# EAGLE design ProDuino-v2 (EAGLE 6.5.0)
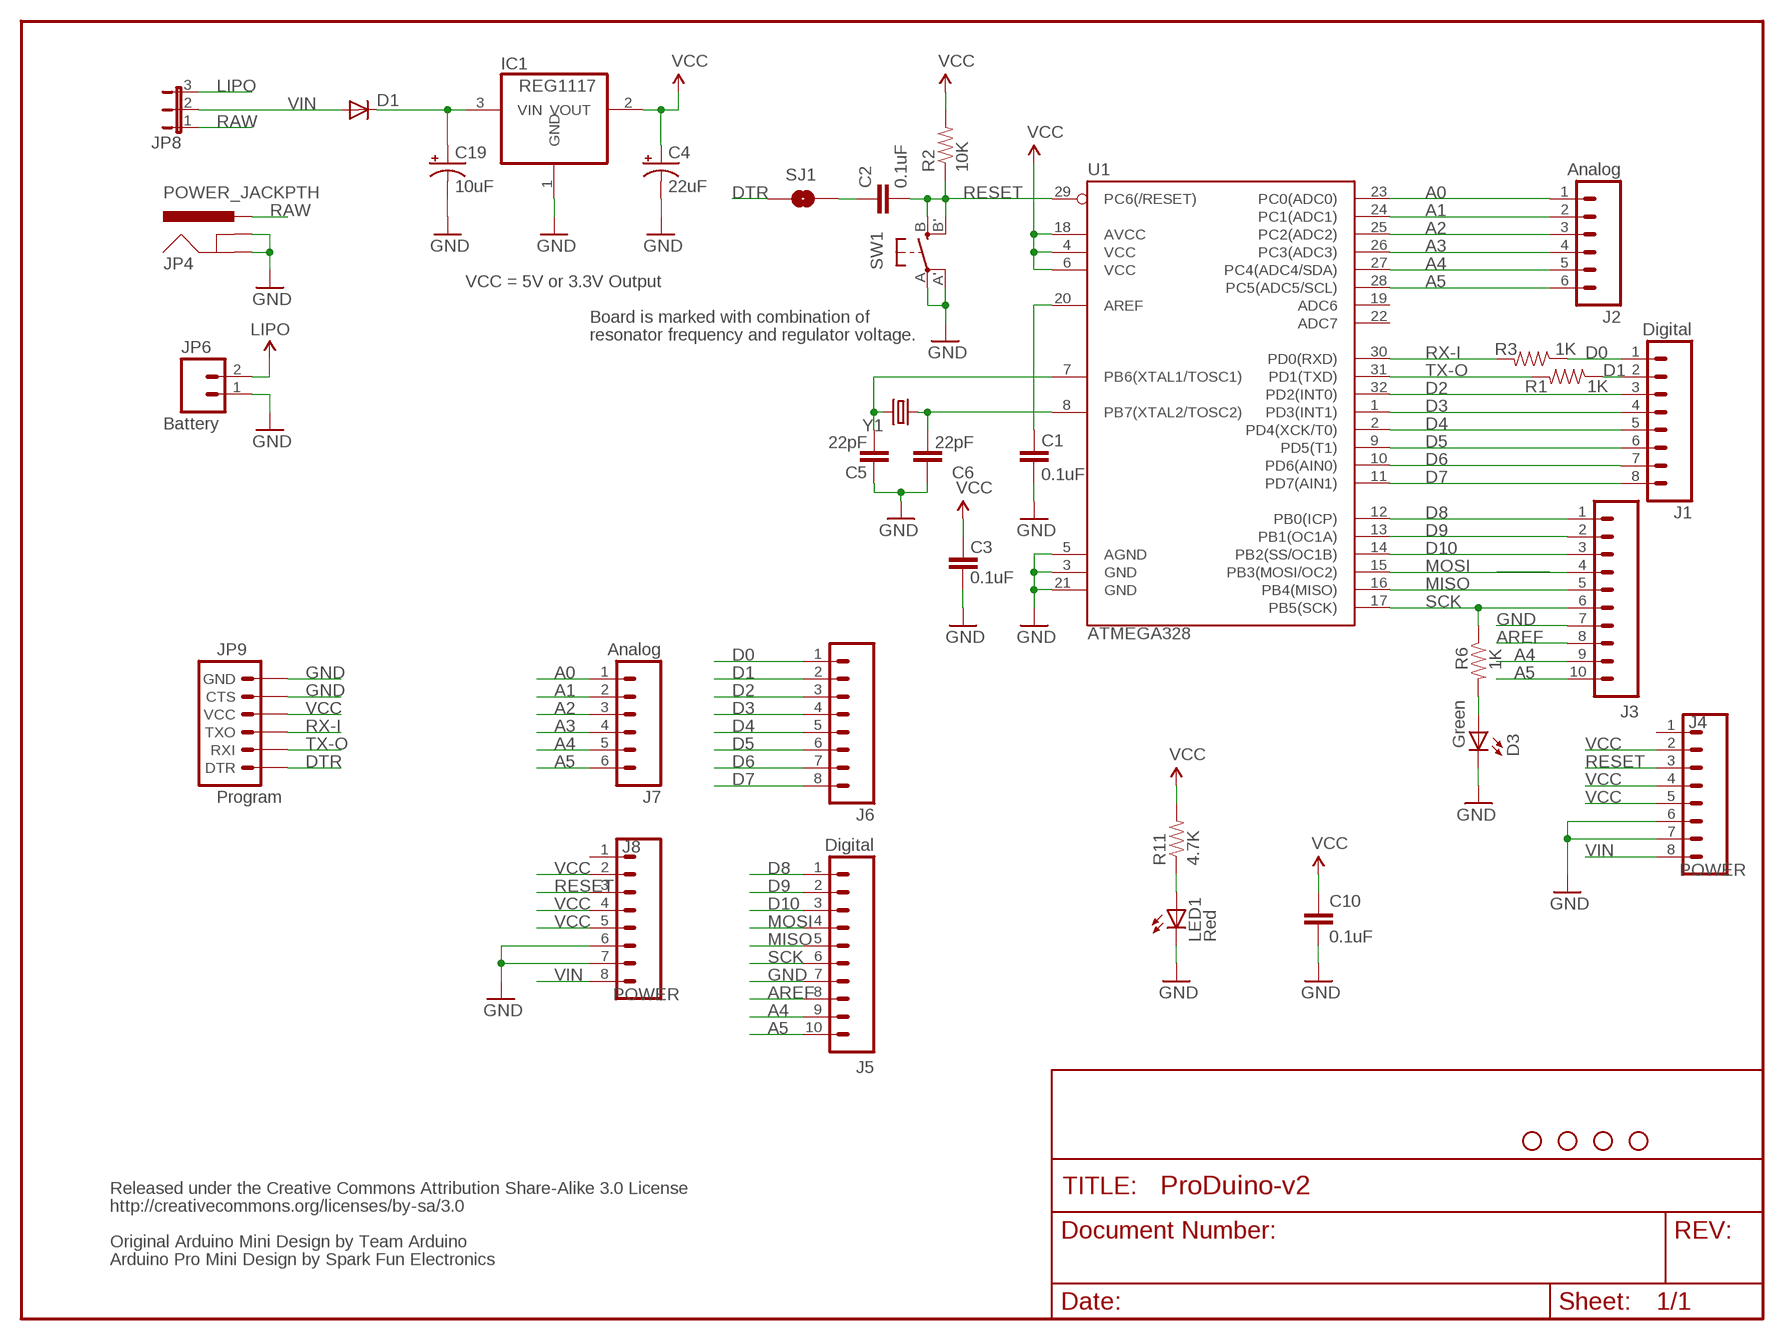
[diagram p0: schematic, sheet 1]

## Parts
C1  0.1uF  CAP0603-CAP  [0603-CAP]
C2  0.1uF  CAP0603-CAP  [0603-CAP]
C3  0.1uF  CAP0603-CAP  [0603-CAP]
C4  22uF  CAP_POL1206  [EIA3216]
C5  22pF  CAP0603-CAP  [0603-CAP]
C6  22pF  CAP0603-CAP  [0603-CAP]
C10  0.1uF  CAP0603-CAP  [0603-CAP]
C19  10uF  CAP_POL1206  [EIA3216]
D1  DIODESMA  [SMA-DIODE]
D3  Green  LED0603  [LED-0603]
IC1  REG1117  [SOT223]
J1  Digital  M081X08  [1X08]
J2  Analog  M06SIP  [1X06]
J3  M10"  [1X10]
J4  POWER  M081X08  [1X08]
J5  Digital  M10"  [1X10]
J6  M081X08  [1X08]
J7  Analog  M06SIP  [1X06]
J8  POWER  M081X08  [1X08]
JP4  POWER_JACKPTH  [POWER_JACK_PTH]
JP6  Battery  M02PTH  [1X02]
JP8  JP2E  [JP2]
JP9  Program  ARDUINO_SERIAL_PROGRAMPTH  [1X06]
LED1  Red  LED0603  [LED-0603]
R1  1K  RESISTOR0603-RES  [0603-RES]
R2  10K  RESISTOR0603-RES  [0603-RES]
R3  1K  RESISTOR0603-RES  [0603-RES]
R6  1K  RESISTOR0603-RES  [0603-RES]
R11  4.7K  RESISTOR0603-RES  [0603-RES]
SJ1  SOLDERJUMPERNC3  SOLDERJUMPERNC2  [SJ_2S-NOTRACE]
SW1  SPST_TACT-EVQQ2  [EVQ-Q2]
U1  ATMEGA328  ATMEGA168  [TQFP32-08]
U$1  STAND-OFF  [STAND-OFF]
U$3  STAND-OFF  [STAND-OFF]
U$9  STAND-OFF  [STAND-OFF]
U$10  STAND-OFF  [STAND-OFF]
Y1  CRYSTAL5X3  [CRYSTAL-SMD-5X3]

## Nets
A0: J2.1 J7.1 U1.23(PC0(ADC0))
A1: J2.2 J7.2 U1.24(PC1(ADC1))
A2: J2.3 J7.3 U1.25(PC2(ADC2))
A3: J2.4 J7.4 U1.26(PC3(ADC3))
A4: J2.5 J3.9 J5.9 J7.5 U1.27(PC4(ADC4/SDA))
A5: J2.6 J3.10 J5.10 J7.6 U1.28(PC5(ADC5/SCL))
AREF: C1.2 J3.8 J5.8 U1.20(AREF)
D0: J1.1 J6.1 R3.1
D1: J1.2 J6.2 R1.1
D2: J1.3 J6.3 U1.32(PD2(INT0))
D3: J1.4 J6.4 U1.1(PD3(INT1))
D4: J1.5 J6.5 U1.2(PD4(XCK/T0))
D5: J1.6 J6.6 U1.9(PD5(T1))
D6: J1.7 J6.7 U1.10(PD6(AIN0))
D7: J1.8 J6.8 U1.11(PD7(AIN1))
D8: J3.1 J5.1 U1.12(PB0(ICP))
D9: J3.2 J5.2 U1.13(PB1(OC1A))
D10: J3.3 J5.3 U1.14(PB2(SS/OC1B))
DTR: JP9.1(DTR) SJ1.1
GND [vcc]: C1.1 C3.1 C4.C(-) C5.2 C6.2 C10.2 C19.C(-) D3.C IC1.1(GND) J3.7 J4.6 J4.7 J5.7 J8.6 J8.7 JP4.GND JP4.GNDBREAK JP6.1 JP9.5(CTS) JP9.6(GND) LED1.C SW1.A'(P1) SW1.A(P) U1.3(GND) U1.5(AGND) U1.21(GND)
LIPO: JP6.2 JP8.3
MISO: J3.5 J5.5 U1.16(PB4(MISO))
MOSI: J3.4 J5.4 U1.15(PB3(MOSI/OC2))
N$1: C2.1 SJ1.2
N$2: C5.1 U1.7(PB6(XTAL1/TOSC1)) Y1.3
N$3: C6.1 U1.8(PB7(XTAL2/TOSC2)) Y1.1
N$5: C19.A(+) D1.C IC1.3(VIN)
N$7: D3.A R6.2
N$38: LED1.A R11.1
RAW [vcc]: JP4.PWR JP8.1
RESET: C2.2 J4.3 J8.3 R2.1 SW1.B'(S1) SW1.B(S) U1.29(PC6(/RESET))
RX-I: JP9.3(TXO) R3.2 U1.30(PD0(RXD))
SCK: J3.6 J5.6 R6.1 U1.17(PB5(SCK))
TX-O: JP9.2(RXI) R1.2 U1.31(PD1(TXD))
VCC: C3.2 C4.A(+) C10.1 IC1.2(VOUT) J4.2 J4.4 J4.5 J8.2 J8.4 J8.5 JP9.4(VCC) R2.2 R11.2 U1.4(VCC) U1.6(VCC) U1.18(AVCC)
VIN [vcc]: D1.A J4.8 J8.8 JP8.2
Unconnected: J4.1 J8.1 U1.19(ADC6) U1.22(ADC7)

## Notes on the sheet
- VCC = 5V or 3.3V Output
- Board is marked with combination of
- resonator frequency and regulator voltage.
- Released under the Creative Commons Attribution Share-Alike 3.0 License
- http://creativecommons.org/licenses/by-sa/3.0
- Original Arduino Mini Design by Team Arduino
- Arduino Pro Mini Design by Spark Fun Electronics

## Library data of the parts
C1-C3 C5 C6 C10 = SparkFun-Capacitors:CAP: Capacitor Standard 0603 ceramic capacitor, and 0.1" leaded capacitor.
C4 C19 = SparkFun:CAP_POL: Capacitor Polarized These are standard SMD and PTH capacitors. Normally 10uF, 47uF, and 100uF in electrolytic and tantalum varieties. Always verify the external diameter of the through hole cap, it varies with capacity, voltage, and manufacturer. The EIA devices should be standard.
D1 = SparkFun-DiscreteSemi:DIODE: Diode These are standard reverse protection diodes and small signal diodes. SMA package can handle up to about 1A. SOD-323 can handle about 200mA. What the SOD-323 package when ordering, there are some mfgs out there that are 5-pin packages.
D3 LED1 = SparkFun:LED: LEDs Standard schematic elements and footprints for 5mm, 3mm, 1206, and 0603 sized LEDs. 5mm - Spark Fun Electronics SKU : COM-00529 (and others)
IC1 = burr-brown:REG1117: 800mA and 1A Low Dropout (LDO) Positive Regulator 1.8V, 2.5V, 2.85V, 3.3V, 5V, and Adj; MPN: REG1117; OC_FARNELL: 1097566; OC_NEWARK: 14P6981
J1 J6 = SparkFun:M08: Header 8 Standard 8-pin 0.1" header. Use with straight break away headers (SKU : PRT-00116), right angle break away headers (PRT-00553), swiss pins (PRT-00743), machine pins (PRT-00117), and female headers (PRT-00115).
J2 J7 = SparkFun:M06: Header 6 Standard 6-pin 0.1" header. Use with straight break away headers (SKU : PRT-00116), right angle break away headers (PRT-00553), swiss pins (PRT-00743), machine pins (PRT-00117), and female headers (PRT-00115). Molex polarized connector foot print use with SKU : PRT-08094 with associated crimp pins and housings. NOTES ON THE VARIANTS LOCK and LOCK_LONGPADS... This footprint was designed to help hold the alignment of a through-hole component (i.e. 6-pin header) while soldering it into place. You may notice that each hole has been shifted either up or down by 0.005 of an inch from it's more standard position (which is a perfectly straight line). This slight alteration caused the pins (the squares in the middle) to touch the edges of the holes. Because they are alternating, it causes a "brace" to hold the component in place. 0.005 has proven to be the perfect amount of "off-center" position when using our standard breakaway headers. Although looks a little odd when you look at the bare footprint, once you have a header in there, the alteration is very hard to notice. Also, if you push a header all the way into place, it is covered up entirely on the bottom side. This idea of altering the position of holes to aid alignment will be further integrated into the Sparkfun Library for other footprints. It can help hold any component with 3 or more connection pins.
J3 J5 = SparkFun-Connectors:M10: Header 10 Standard 10-pin 0.1" header. Use with straight break away headers (SKU : PRT-00116), right angle break away headers (PRT-00553), swiss pins (PRT-00743), machine pins (PRT-00117), and female headers (PRT-00115).
J4 J8 = SparkFun-Connectors:M08: Header 8 Standard 8-pin 0.1" header. Use with straight break away headers (SKU : PRT-00116), right angle break away headers (PRT-00553), swiss pins (PRT-00743), machine pins (PRT-00117), and female headers (PRT-00115).
JP4 = SparkFun:POWER_JACK: Power Jack This is the standard 5.5mm barrel jack for power. The PTH is the most common, proven, reliable, footprint. All others are experimental. The Slot footprint only works if the mill layer is transmitted to the PCB fab house so be warned. Spark Fun Electronics SKU : PRT-00119. Mating wall wart : TOL-00298 (and others)
JP6 = SparkFun:M02: Header 2 Standard 2-pin 0.1" header. Use with straight break away headers (SKU : PRT-00116), right angle break away headers (PRT-00553), swiss pins (PRT-00743), machine pins (PRT-00117), and female headers (PRT-00115). Molex polarized connector foot print use with SKU : PRT-08233 with associated crimp pins and housings.
JP8 = jumper:JP2E: JUMPER
JP9 = SparkFun:ARDUINO_SERIAL_PROGRAM
R1-R3 R6 R11 = SparkFun-Resistors:RESISTOR: Resistor Basic schematic elements and footprints for 0603, 1206, and PTH resistors.
SJ1 = SparkFun-Passives:SOLDERJUMPER: Solder Jumper Standard SMD solder jumper. Used to automate production. Two varients : Normally Open and Normally Closed are the same, but have different paste layers. NC will have a large amount of paste and should jumper during reflow.
SW1 = adafruit:SPST_TACT: SMT 6mm switch, EVQQ2 series http://www.ladyada.net/library/eagle
U1 = SparkFun:ATMEGA168
U$1 U$3 U$9 U$10 = SparkFun:STAND-OFF: Stand Off This is the mechanical footprint for a #4 phillips button head screw. Use the keepout ring to avoid running the screw head into surrounding components. SKU : PRT-00447
Y1 = SparkFun-FreqCtrl:CRYSTAL: Various standard crystals. Proven footprints. Spark Fun Electronics SKU : COM-00534

## Net classes
0 default: width 0.203 mm
1 vcc: width 0.254 mm

## Board
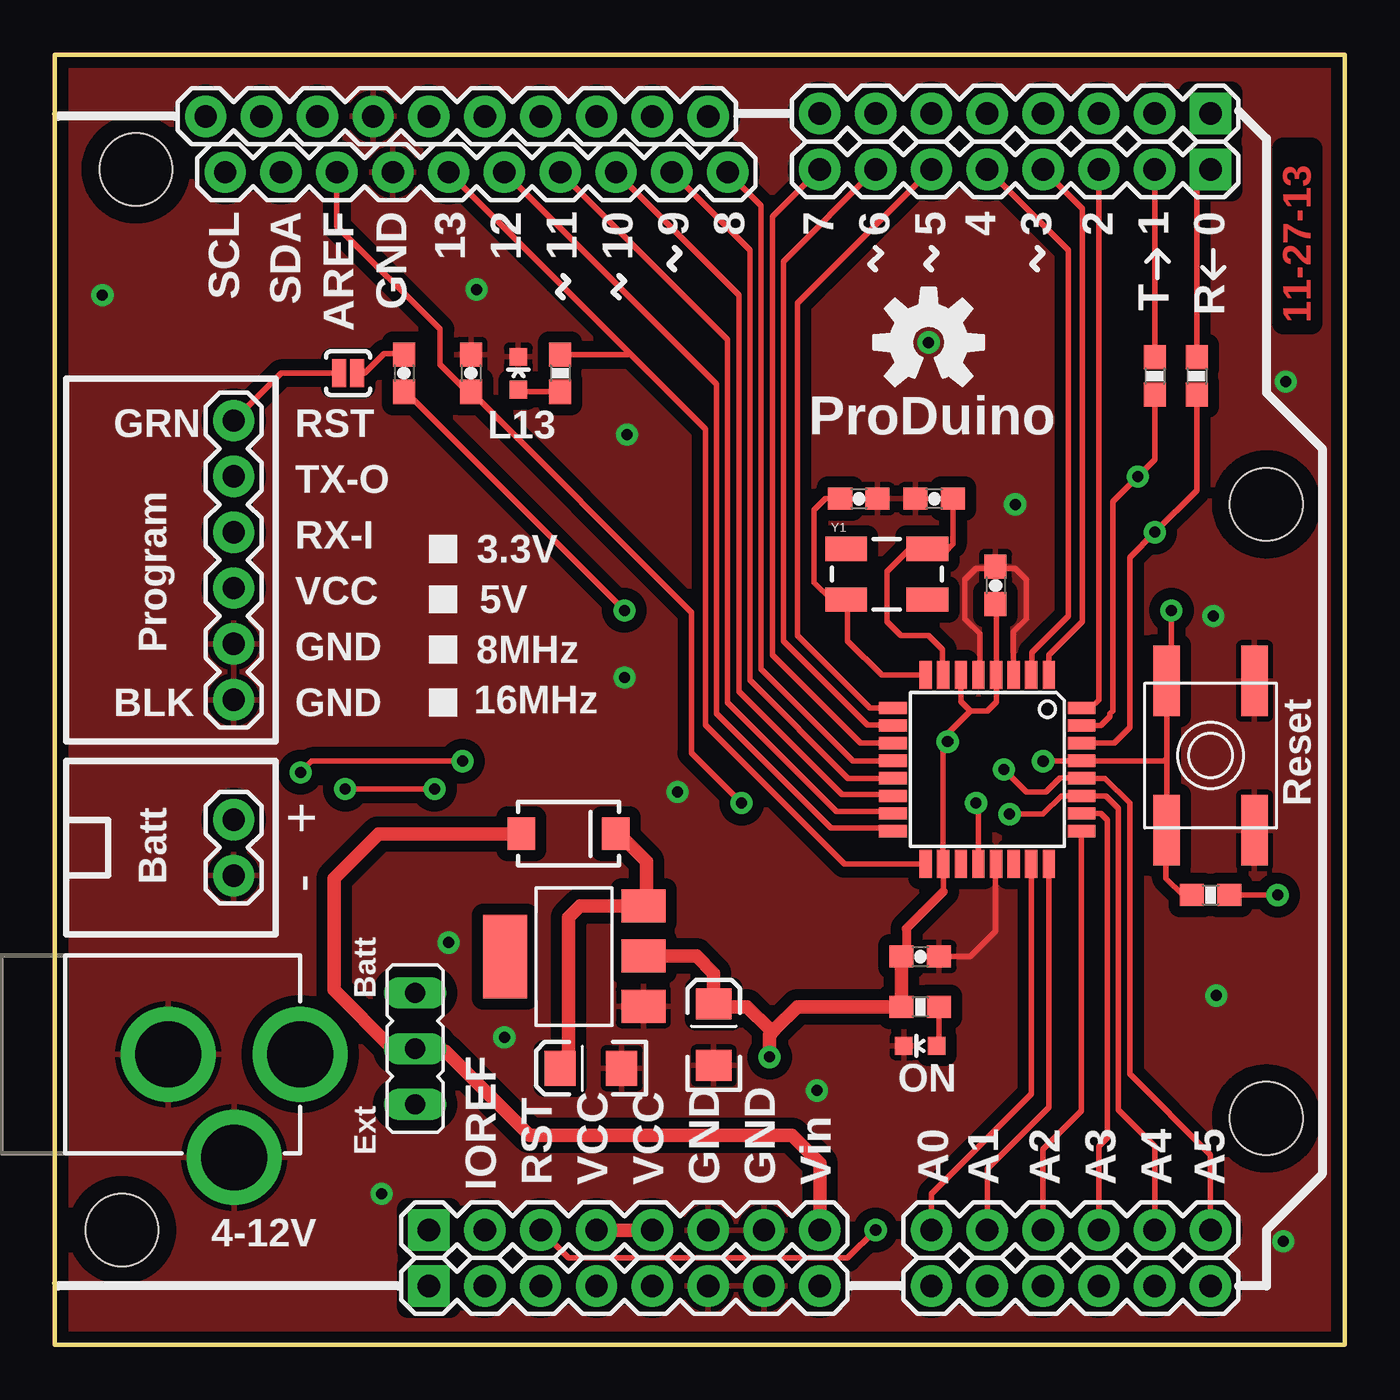
[diagram p1: board, top side]
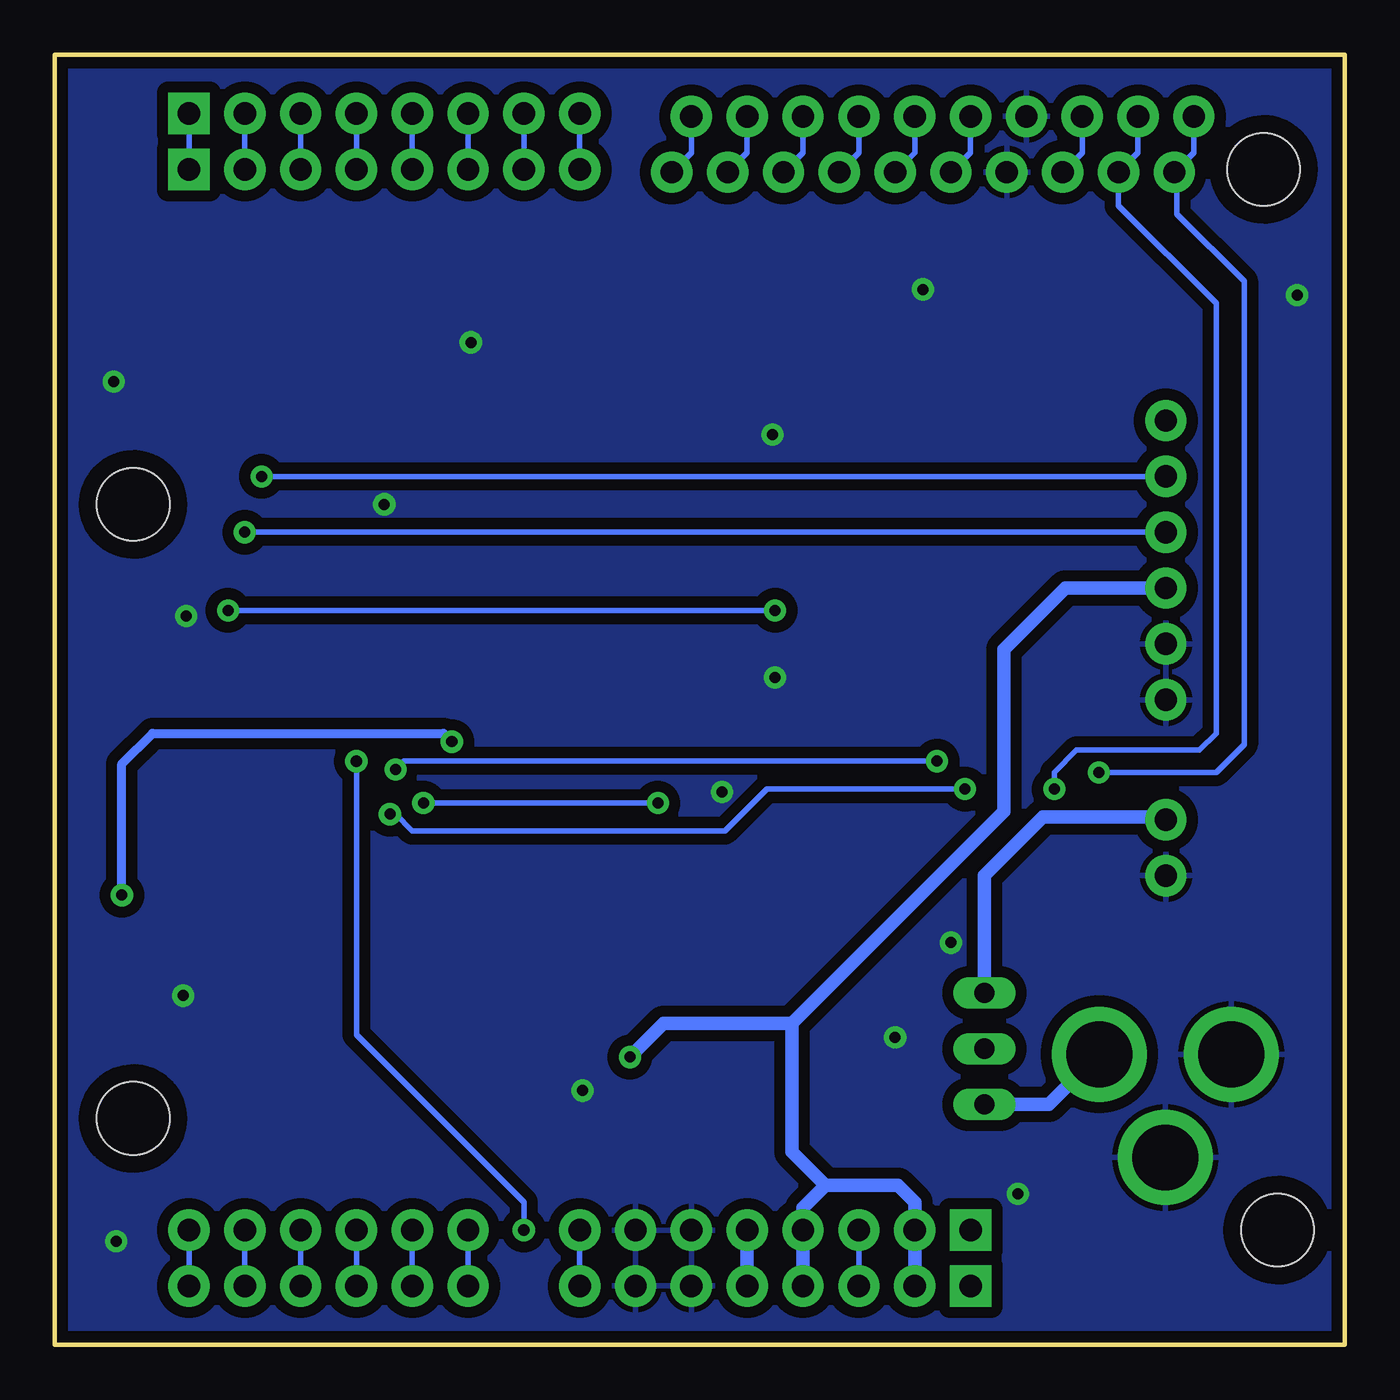
[diagram p2: board, bottom side, seen from below]

Size 58.67 x 58.67 mm. Coordinates in mm from the lower left corner, seen from the top.
Outline: 0,58.67 0,0 58.67,0 58.67,58.67 0,58.67
Copper layers (1*16): Top 0.035mm / dielectric 1.5mm / Bottom 0.035mm
Design rules "SparkFun *": minimum track width 8mil, minimum drill 0.3mm, track to track 8mil, track to pad 8mil, pad to pad 8mil, via to via 8mil, smd to smd 8mil, copper to edge 10mil, drill to drill 8mil, minimum pad ring 10mil, minimum via ring 10mil, stop-mask expansion 4mil, vias tented up to drill 20mil, thermal gap 10mil

### Footprints (pad centres in the part's own frame; a part is rotated, then mirrored left to right if it is on the bottom)
0603-CAP = smd 1.1 x 1: 1 -0.85,0; 2 0.85,0
EIA3216 = smd 1.4 x 1.6: A 1.4,0; C -1.4,0
SMA-DIODE = smd 1.27 x 1.47: A -2.15,0; C 2.15,0
LED-0603 = smd 0.8 x 0.8: A 0,-0.75; C 0,0.75
SOT223 = smd 1.499 x 2.007: 1 -2.261,-3.15; 2 0.025,-3.15; 3 2.311,-3.15 | smd 3.81 x 2.007: 4 0,3.15
1X08 = drill 1.016 pad 1.88 square: 1 0,0 | drill 1.016 pad 1.88: 2 2.54,0; 3 5.08,0; 4 7.62,0; 5 10.16,0; 6 12.7,0; 7 15.24,0; 8 17.78,0
1X06 = drill 1.016 pad 1.88: 1 0,0; 2 2.54,0; 3 5.08,0; 4 7.62,0; 5 10.16,0; 6 12.7,0
1X10 = drill 1.016 pad 1.88: 1 0,0; 2 2.54,0; 3 5.08,0; 4 7.62,0; 5 10.16,0; 6 12.7,0; 7 15.24,0; 8 17.78,0; 9 20.32,0; 10 22.86,0
POWER_JACK_PTH = drill 2.997 pad 4.318: GND 0,7.7; GNDBREAK 4.7,10.7; PWR 0,13.7
1X02 = drill 1.016 pad 1.88: 1 0,0; 2 2.54,0
JP2 = drill 0.914 long: 1 -2.54,0; 2 0,0; 3 2.54,0
0603-RES = smd 1.1 x 1: 1 -0.85,0; 2 0.85,0
SJ_2S-NOTRACE = smd 0.635 x 1.27: 1 -0.401,0; 2 0.413,0
EVQ-Q2 = smd 3.2 x 1.2: A -3.4,-2; A' 3.4,-2; B -3.4,2; B' 3.4,2
TQFP32-08 = smd 1.27 x 0.559: 1 -4.293,2.8; 2 -4.293,2; 3 -4.293,1.2; 4 -4.293,0.4; 5 -4.293,-0.4; 6 -4.293,-1.2; 7 -4.293,-2; 8 -4.293,-2.8; 17 4.293,-2.8; 18 4.293,-2; 19 4.293,-1.2; 20 4.293,-0.4; 21 4.293,0.4; 22 4.293,1.2; 23 4.293,2; 24 4.293,2.8 | smd 0.559 x 1.27: 9 -2.8,-4.293; 10 -2,-4.293; 11 -1.2,-4.293; 12 -0.4,-4.293; 13 0.4,-4.293; 14 1.2,-4.293; 15 2,-4.293; 16 2.8,-4.293; 25 2.8,4.293; 26 2,4.293; 27 1.2,4.293; 28 0.4,4.293; 29 -0.4,4.293; 30 -1.2,4.293; 31 -2,4.293; 32 -2.8,4.293
STAND-OFF = hole 3.302: 0,0
CRYSTAL-SMD-5X3 = smd 1.9 x 1.1: 1 -1.85,-1.15; 2 1.85,-1.15; 3 1.85,1.15; 4 -1.85,1.15

### Placement (x,y rotation side)
C1  18.92,44.2 270 top
C2  15.88,44.2 270 top
C3  42.8,34.54 270 top
C4  29.97,14.1 90 top
C5  40.01,38.48 180 top
C6  36.58,38.48 0 top
C10  39.37,17.65 0 top
C19  24.38,12.57 180 top
D1  23.37,23.24 0 top
D3  21.08,44.2 0 top
IC1  23.62,17.65 90 top
J1  52.58,56.01 180 top
J2  39.88,5.21 0 top
J3  29.72,55.88 180 top
J4  17.02,5.21 0 top
J5  30.61,53.34 180 top
J6  52.58,53.47 180 top
J7  39.88,2.67 0 top
J8  17.02,2.67 0 top
JP4  -2.54,13.21 270 top
JP6  8.13,21.34 90 top
JP8  16.38,13.46 90 top
JP9  8.13,42.04 270 top
LED1  39.37,13.59 90 top
R1  50.04,44.07 270 top
R2  52.58,20.45 0 top
R3  51.94,44.07 270 top
R6  22.99,44.2 270 top
R11  39.37,15.37 180 top
SJ1  13.33,44.2 0 top
SW1  52.58,26.8 90 top
U1  42.42,26.16 270 top
U$1  3.68,53.47 0 top
U$2  [OSHW-LOGO-M]  39.75,45.59 0 top
U$3  3.05,5.21 0 top
U$9  55.12,38.23 0 top
U$10  55.12,10.29 0 top
Y1  37.85,35.05 0 top

### Tracks (layer width: path | path; a pad name or v marks a point on that pad's centre or on a via)
A0
  Top 0.254: J2.1 39.88,6.86 44.42,11.4 U1.23
  Bottom 0.254: J2.1 J7.1
A1
  Top 0.254: J2.2 42.42,8 45.22,10.8 U1.24
  Bottom 0.254: J2.2 J7.2
A2
  Top 0.254: J2.3 45.09,5.33 44.96,5.46 44.96,8.89 46.71,10.64 U1.25
  Bottom 0.254: J2.3 J7.3
A3
  Top 0.254: U1.26 47.59,24.16 47.88,23.88 47.88,9.4 47.5,9.02 J2.4
  Bottom 0.254: J2.4 J7.4
A4  (via drill 0.5)
  Top 0.254: J2.5 50.04,9.02 48.39,10.67 48.39,24.38 47.81,24.96 U1.27 45.79,24.96 44.96,24.13 v43.43,24.13 | v13.21,25.27 v17.27,25.27
  Bottom 0.254: J3.9 9.4,54.23 J5.9 10.29,51.82 5.84,47.37 5.84,27.81 6.6,27.05 12.19,27.05 13.21,26.04 v13.21,25.27 | v43.43,24.13 43.18,24.13 42.42,23.37 28.19,23.37 26.29,25.27 v17.27,25.27 | J2.5 J7.5
A5  (via drill 0.5)
  Top 0.254: J2.6 52.58,8.64 48.9,12.32 48.9,24.64 47.77,25.76 U1.28 46.69,25.78 45.72,25.78 45.09,25.15 44.2,25.15 v43.18,26.16 | v18.54,26.54 11.68,26.54 v11.18,26.04
  Bottom 0.254: J3.10 6.86,54.23 J5.10 7.62,53.21 7.62,51.43 4.57,48.39 4.57,27.3 5.84,26.04 v11.18,26.04 | v18.54,26.54 42.8,26.54 v43.18,26.16 | J2.6 J7.6
AREF  (via drill 0.5)
  Top 0.254: J5.8 12.83,50.89 17.53,46.19 17.53,44.58 18.76,43.35 C1.2 28.96,33.31 28.96,26.92 v31.24,24.64 | U1.20 42.02,24.53 v41.91,24.64
  Bottom 0.254: J3.8 11.94,54.23 J5.8 | v41.91,24.64 v31.24,24.64
D0
  Top 0.254: R3.1 51.94,52.83 J6.1
  Bottom 0.254: J1.1 J6.1
D1
  Top 0.254: R1.1 J6.2
  Bottom 0.254: J1.2 J6.2
D2
  Top 0.254: U1.32 47.11,28.96 47.12,28.96 47.5,29.34 J6.3
  Bottom 0.254: J1.3 J6.3
D3
  Top 0.254: U1.1 45.22,31.38 46.74,32.89 46.74,51.69 J6.4
  Bottom 0.254: J1.4 J6.4
D4
  Top 0.254: J6.5 46.1,49.78 46.1,33.15 44.45,31.5 44.45,30.49 U1.2
  Bottom 0.254: J1.5 J6.5
D5
  Top 0.254: U1.9 37.08,28.96 33.78,32.26 33.78,47.37 J6.6
  Bottom 0.254: J1.6 J6.6
D6
  Top 0.254: U1.10 38.01,28.16 37.97,28.19 36.96,28.19 33.15,32 33.15,49.28 J6.7
  Bottom 0.254: J1.7 J6.7
D7
  Top 0.254: U1.11 36.65,27.36 32.64,31.37 32.64,51.31 J6.8
  Bottom 0.254: J1.8 J6.8
D8
  Top 0.254: U1.12 36.3,26.56 32.13,30.73 32.13,51.82 J5.1
  Bottom 0.254: J3.1 29.72,54.23 J5.1
D9
  Top 0.254: J5.2 31.62,49.78 31.62,30.23 36.09,25.76 U1.13
  Bottom 0.254: J3.2 27.18,54.23 J5.2
D10
  Top 0.254: U1.14 38.1,24.99 38.1,25.02 35.81,25.02 31.11,29.72 31.11,47.75 J5.3
  Bottom 0.254: J3.3 24.64,54.23 J5.3
DTR
  Top 0.254: SJ1.1 10.29,44.2 JP9.1
GND  (via drill 0.5)
  Top 0.254: U1.5 42.08,30.46 42.08,32.35 41.4,33.02 41.4,34.8 41.91,35.31 42.71,35.31 C3.1 42.89,35.31 43.69,35.31 44.2,34.8 44.2,33.02 43.62,32.44 U1.3 | C10.2 41.66,17.65 42.8,18.8 42.8,21.85 U1.21
  other vias: 39.75,45.59 25.91,30.35 43.69,38.23 52.83,15.87 26.04,41.4 14.86,6.86 34.67,11.56 17.91,18.29 56.01,43.81 52.7,33.15 2.16,47.75 55.88,4.7 19.18,48.01 20.45,13.97 28.32,25.15
  pour Top (isolate 0.508): -0.51,58.67 59.18,58.67 59.18,0 -0.38,0
  pour Bottom (isolate 0.508): -0.76,58.67 58.93,58.67 58.93,0.13 -0.64,0
LIPO
  Bottom 0.61: JP8.3 16.38,21.34 13.72,24 8.25,24 JP6.2
MISO
  Top 0.254: U1.16 38.12,23.39 38.23,23.5 35.31,23.5 30.1,28.7 30.1,43.69 J5.5
  Bottom 0.254: J3.5 19.56,54.23 J5.5
MOSI
  Top 0.254: 38.23,24.13 38.16,24.13 U1.15 | 38.23,24.13 38.2,24.16 U1.15 | 38.23,24.13 38.35,24.26 | U1.15 38.12,24.23 38.1,24.26 35.56,24.26 30.61,29.21 30.61,45.72 J5.4
  Bottom 0.254: J3.4 22.1,54.23 J5.4
N$1
  Top 0.254: SJ1.2 14.1,44.2 14.99,45.09 15.84,45.09 C2.1
N$2
  Top 0.254: C5.1 40.85,36.41 40.51,36.07 39.83,36.07 Y1.3 38.87,36.2 37.85,35.18 37.85,32.89 38.48,32.26 39.75,32.26 40.39,31.62 40.39,30.49 U1.7
N$3
  Top 0.254: U1.8 37.62,30.46 36.07,32 36.07,33.83 Y1.1 35.31,33.91 34.54,34.67 34.54,37.97 35.05,38.48 C6.1
N$5
  Top 0.61: C19.A 23.37,12.96 23.37,19.43 23.9,19.96 IC1.3 26.92,20.12 26.92,21.97 25.65,23.24 D1.C 25.4,23.24
N$7
  Top 0.254: R6.2 21.18,43.35 D3.A
N$38
  Top 0.254: R11.1 40.22,13.69 LED1.A
RAW
  Bottom 0.61: JP8.1 13.45,10.92 JP4.PWR
RESET  (via drill 0.5, 0.51)
  Top 0.254: v37.34,5.21 36.07,3.94 23.37,3.94 J4.3 | v44.96,26.54 46.61,26.54 46.63,26.56 U1.29 46.84,26.56 | 46.84,26.56 46.86,26.54 | R2.1 51.31,20.45 50.55,21.21 50.55,23.37 SW1.B 50.58,26.67 | SW1.B' 50.58,29.34 | 50.58,29.34 50.58,26.67 | C2.2 15.96,43.35 v25.91,33.4 | v50.8,33.4 50.8,29.56 50.58,29.34 | 46.84,26.56 50.47,26.56 50.58,26.67
  Bottom 0.254: v44.96,26.54 44.96,14.1 37.34,6.48 v37.34,5.21 | v25.91,33.4 v50.8,33.4 | J8.3 J4.3
RX-I  (via drill 0.5)
  Top 0.254: U1.30 48.19,27.36 48.9,28.07 48.9,35.81 v50.04,36.96 51.94,38.86 R3.2
  Bottom 0.254: JP9.3 v50.04,36.96
SCK
  Top 0.254: 26.2,45.05 29.59,41.66 29.59,28.19 35.92,21.87 U1.17 | 26.2,45.05 J5.6 | R6.1 26.2,45.05
  Bottom 0.254: J3.6 17.02,54.23 J5.6
TX-O  (via drill 0.5)
  Top 0.254: U1.31 47.59,28.16 48.01,28.58 48.01,28.7 48.13,28.83 48.13,38.35 v49.28,39.5 50.04,40.26 R1.2
  Bottom 0.254: JP9.2 v49.28,39.5
VCC  (via drill 0.5, 0.51)
  Top 0.254: U1.4 | U1.6 41.22,29.27 41.66,28.83 | U1.4 42.82,33.67 C3.2 | 41.66,28.83 40.62,27.79 v40.62,27.43 40.41,27.23 U1.18 40.42,20.61 | U1.4 42.82,29.23 42.42,28.83 41.66,28.83 | 38.73,17.87 C10.1 | R2.2 v55.63,20.45
  Top 0.406: 32.77,14.35 32.51,14.35 | 30.1,15.37 C4.A | 40.42,20.61 38.73,18.92 38.73,17.87
  Top 0.61: J4.4 J4.5 | IC1.2 29.18,17.68 29.97,16.89 C4.A | 32.51,14.35 31.5,15.37 30.1,15.37 | v32.51,13.08 32.51,14.1 32.77,14.35 33.78,15.37 R11.2 C10.1
  Bottom 0.406: v55.63,20.45 55.63,26.42 54.23,27.81 41,27.81 v40.62,27.43
  Bottom 0.61: JP9.4 12.7,34.42 15.49,31.62 15.49,24.26 25.15,14.6 | 23.62,7.24 24.64,6.22 J4.4 J8.4 | 23.62,7.24 20.32,7.24 19.56,6.48 J4.2 J8.2 | 25.15,14.6 25.15,8.76 23.62,7.24 | 25.15,14.6 30.99,14.6 v32.51,13.08 | J4.5 J8.5
VIN
  Top 0.61: J4.8 34.8,8.25 33.53,9.52 21.59,9.52 17.78,13.33 16.51,13.33 JP8.2 15.37,13.46 12.7,16.13 12.7,21.21 14.73,23.24 D1.A
  Bottom 0.254: J4.8 J8.8

### Text on the board
Top: 11-27-13
tPlace: SCL | SDA | AREF | GND | 13 | 12 | 11 | 10 | 9 | 8 | 7 | 6 | 5 | 4 | 3 | 2 | 1 | 0 | T | R | ProDuino | GRN | RST | L13 | TX-O | RX-I | 3.3V | VCC | 5V | Program | GND | 8MHz | BLK | GND | 16MHz | Reset | + | Batt | - | Batt | ON | Ext | IOREF | RST | VCC | VCC | GND | GND | Vin | A0 | A1 | A2 | A3 | A4 | A5 | 4-12V